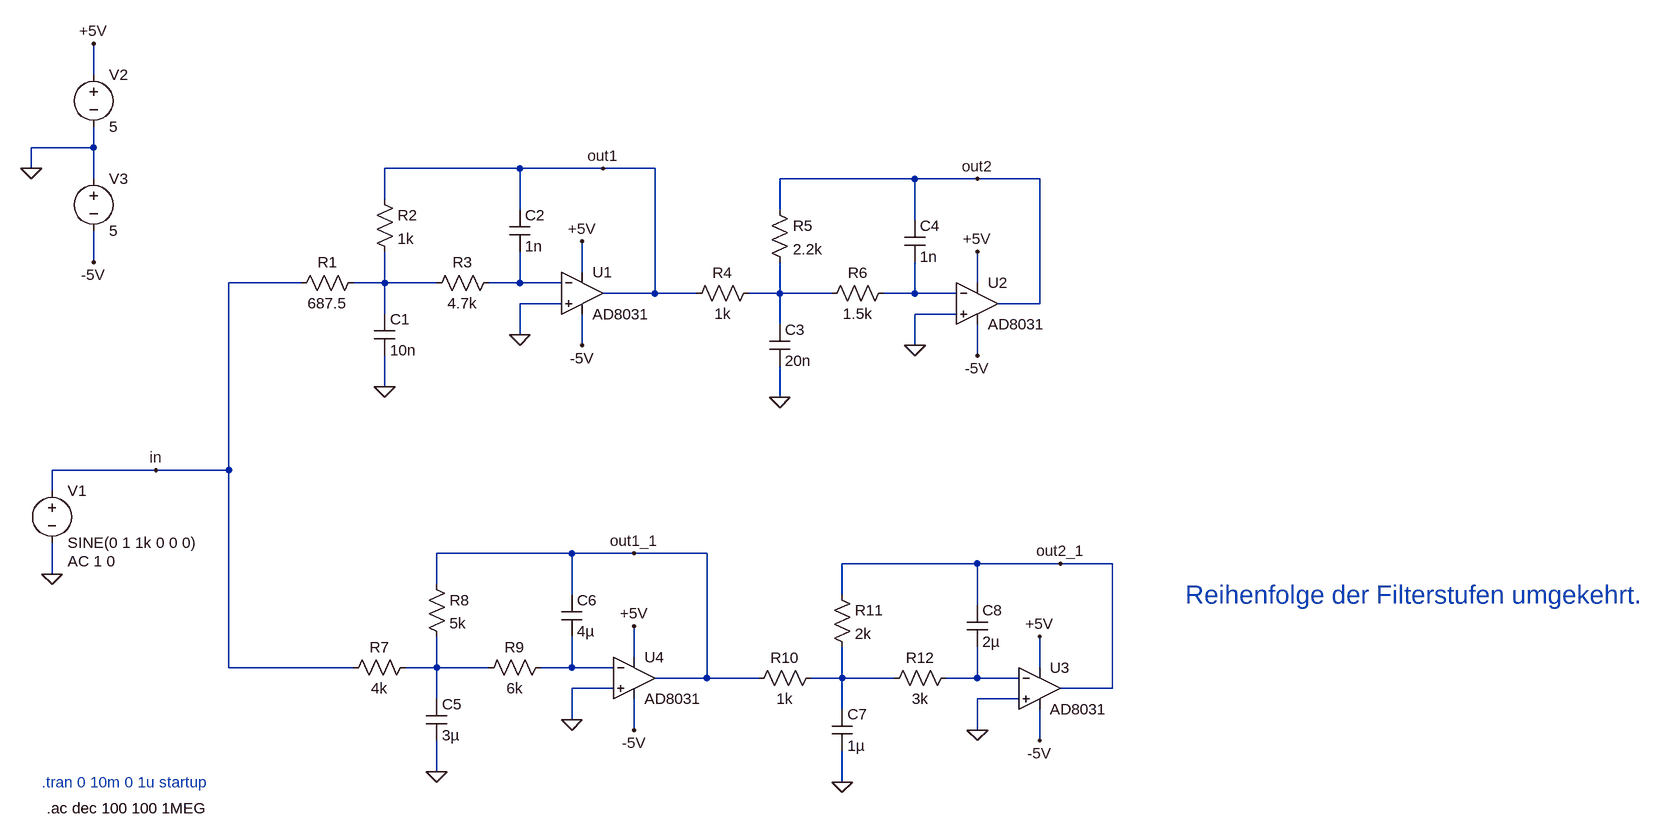
[diagram p0: schematic Tiefpass_Ordnung_4.asc]
Tiefpass_Ordnung_4.asc, the LTspice schematic file:
Version 4
SHEET 1 2400 680
WIRE -640 -464 -640 -512
WIRE -640 -352 -640 -384
WIRE -640 -352 -736 -352
WIRE -736 -320 -736 -352
WIRE 16 -320 -192 -320
WIRE 144 -320 16 -320
WIRE 224 -320 144 -320
WIRE -640 -304 -640 -352
WIRE 624 -304 416 -304
WIRE 720 -304 624 -304
WIRE 816 -304 720 -304
WIRE -192 -272 -192 -320
WIRE 16 -256 16 -320
WIRE 416 -256 416 -304
WIRE 624 -240 624 -304
WIRE -640 -176 -640 -224
WIRE 112 -160 112 -208
WIRE -320 -144 -432 -144
WIRE -192 -144 -192 -192
WIRE -192 -144 -240 -144
WIRE -112 -144 -192 -144
WIRE 16 -144 16 -192
WIRE 16 -144 -32 -144
WIRE 80 -144 16 -144
WIRE 720 -144 720 -192
WIRE 224 -128 224 -320
WIRE 224 -128 144 -128
WIRE 288 -128 224 -128
WIRE 416 -128 416 -176
WIRE 416 -128 368 -128
WIRE 496 -128 416 -128
WIRE 624 -128 624 -176
WIRE 624 -128 576 -128
WIRE 688 -128 624 -128
WIRE 80 -112 16 -112
WIRE 816 -112 816 -304
WIRE 816 -112 752 -112
WIRE -192 -96 -192 -144
WIRE 688 -96 624 -96
WIRE 416 -80 416 -128
WIRE 16 -64 16 -112
WIRE 112 -48 112 -96
WIRE 624 -48 624 -96
WIRE 720 -32 720 -80
WIRE -192 16 -192 -32
WIRE 416 32 416 -16
WIRE -544 144 -704 144
WIRE -432 144 -432 -144
WIRE -432 144 -544 144
WIRE -704 176 -704 144
WIRE 96 272 -112 272
WIRE 192 272 96 272
WIRE 304 272 192 272
WIRE 720 288 512 288
WIRE 848 288 720 288
WIRE 928 288 848 288
WIRE -704 304 -704 256
WIRE -112 320 -112 272
WIRE 96 336 96 272
WIRE 512 336 512 288
WIRE 720 352 720 288
WIRE 192 432 192 384
WIRE -432 448 -432 144
WIRE -240 448 -432 448
WIRE -112 448 -112 400
WIRE -112 448 -160 448
WIRE -32 448 -112 448
WIRE 96 448 96 400
WIRE 96 448 48 448
WIRE 160 448 96 448
WIRE 816 448 816 400
WIRE 304 464 304 272
WIRE 304 464 224 464
WIRE 384 464 304 464
WIRE 512 464 512 416
WIRE 512 464 464 464
WIRE 592 464 512 464
WIRE 720 464 720 416
WIRE 720 464 672 464
WIRE 784 464 720 464
WIRE 160 480 96 480
WIRE 928 480 928 288
WIRE 928 480 848 480
WIRE -112 496 -112 448
WIRE 784 496 720 496
WIRE 512 512 512 464
WIRE 96 528 96 480
WIRE 192 544 192 496
WIRE 720 544 720 496
WIRE 816 560 816 512
WIRE -112 608 -112 560
WIRE 512 624 512 576
FLAG 416 32 0
FLAG 624 -48 0
FLAG 720 -304 out2
FLAG -704 304 0
FLAG -112 608 0
FLAG 96 528 0
FLAG -544 144 in
FLAG 192 272 out1_1
FLAG -736 -320 0
FLAG -640 -512 +5V
FLAG -640 -176 -5V
FLAG 720 -192 +5V
FLAG 192 384 +5V
FLAG 192 544 -5V
FLAG 720 -32 -5V
FLAG -192 16 0
FLAG 16 -64 0
FLAG 112 -208 +5V
FLAG 112 -48 -5V
FLAG 144 -320 out1
FLAG 512 624 0
FLAG 720 544 0
FLAG 816 400 +5V
FLAG 816 560 -5V
FLAG 848 288 out2_1
SYMBOL res 272 -112 R270
WINDOW 0 32 56 VTop 2
WINDOW 3 0 56 VBottom 2
SYMATTR InstName R4
SYMATTR Value 1k
SYMBOL res 400 -272 R0
SYMATTR InstName R5
SYMATTR Value 2.2k
SYMBOL res 592 -144 R90
WINDOW 0 0 56 VBottom 2
WINDOW 3 32 56 VTop 2
SYMATTR InstName R6
SYMATTR Value 1.5k
SYMBOL cap 400 -80 R0
SYMATTR InstName C3
SYMATTR Value 20n
SYMBOL cap 608 -240 R0
SYMATTR InstName C4
SYMATTR Value 1n
SYMBOL voltage -704 160 R0
WINDOW 123 24 124 Left 2
WINDOW 39 0 0 Left 2
SYMATTR Value2 AC 1 0
SYMATTR InstName V1
SYMATTR Value SINE(0 1 1k 0 0 0)
SYMBOL res -256 464 R270
WINDOW 0 32 56 VTop 2
WINDOW 3 0 56 VBottom 2
SYMATTR InstName R7
SYMATTR Value 4k
SYMBOL res -128 304 R0
SYMATTR InstName R8
SYMATTR Value 5k
SYMBOL res 64 432 R90
WINDOW 0 0 56 VBottom 2
WINDOW 3 32 56 VTop 2
SYMATTR InstName R9
SYMATTR Value 6k
SYMBOL cap -128 496 R0
SYMATTR InstName C5
SYMATTR Value 3µ
SYMBOL cap 80 336 R0
SYMATTR InstName C6
SYMATTR Value 4µ
SYMBOL voltage -640 -480 R0
WINDOW 123 0 0 Left 2
WINDOW 39 24 44 Left 2
SYMATTR InstName V2
SYMATTR Value 5
SYMBOL voltage -640 -320 R0
WINDOW 123 0 0 Left 2
WINDOW 39 0 0 Left 2
SYMATTR InstName V3
SYMATTR Value 5
SYMBOL res -336 -128 R270
WINDOW 0 32 56 VTop 2
WINDOW 3 0 56 VBottom 2
SYMATTR InstName R1
SYMATTR Value 687.5
SYMBOL res -208 -288 R0
SYMATTR InstName R2
SYMATTR Value 1k
SYMBOL res -16 -160 R90
WINDOW 0 0 56 VBottom 2
WINDOW 3 32 56 VTop 2
SYMATTR InstName R3
SYMATTR Value 4.7k
SYMBOL cap -208 -96 R0
SYMATTR InstName C1
SYMATTR Value 10n
SYMBOL cap 0 -256 R0
SYMATTR InstName C2
SYMATTR Value 1n
SYMBOL res 368 480 R270
WINDOW 0 32 56 VTop 2
WINDOW 3 0 56 VBottom 2
SYMATTR InstName R10
SYMATTR Value 1k
SYMBOL res 496 320 R0
SYMATTR InstName R11
SYMATTR Value 2k
SYMBOL res 688 448 R90
WINDOW 0 0 56 VBottom 2
WINDOW 3 32 56 VTop 2
SYMATTR InstName R12
SYMATTR Value 3k
SYMBOL cap 496 512 R0
SYMATTR InstName C7
SYMATTR Value 1µ
SYMBOL cap 704 352 R0
SYMATTR InstName C8
SYMATTR Value 2µ
SYMBOL Opamps\\AD8031 112 -192 R0
SYMATTR InstName U1
SYMBOL Opamps\\AD8031 720 -176 R0
SYMATTR InstName U2
SYMBOL Opamps\\AD8031 816 416 R0
SYMATTR InstName U3
SYMBOL Opamps\\AD8031 192 400 R0
SYMATTR InstName U4
TEXT -720 624 Left 2 ;.tran 0 10m 0 1u startup
TEXT 1040 336 Left 4 ;Reihenfolge der Filterstufen umgekehrt.
TEXT -712 664 Left 2 !.ac dec 100 100 1MEG

The netlist it stands for:
* Tiefpass_Ordnung_4.asc
R4 out1 N003 1k
R5 out2 N003 2.2k
R6 N004 N003 1.5k
C3 N003 0 20n
C4 out2 N004 1n
V1 in 0 SINE(0 1 1k 0 0 0) AC 1 0
R7 in N005 4k
R8 out1_1 N005 5k
R9 N006 N005 6k
C5 N005 0 3µ
C6 out1_1 N006 4µ
V2 +5V 0 5
V3 0 -5V 5
R1 in N001 687.5
R2 out1 N001 1k
R3 N002 N001 4.7k
C1 N001 0 10n
C2 out1 N002 1n
R10 out1_1 N007 1k
R11 out2_1 N007 2k
R12 N008 N007 3k
C7 N007 0 1µ
C8 out2_1 N008 2µ
XU1 0 N002 +5V -5V out1 AD8031  ; pins In+ In- V+ V- OUT
XU2 0 N004 +5V -5V out2 AD8031  ; pins In+ In- V+ V- OUT
XU3 0 N008 +5V -5V out2_1 AD8031  ; pins In+ In- V+ V- OUT
XU4 0 N006 +5V -5V out1_1 AD8031  ; pins In+ In- V+ V- OUT
* .tran 0 10m 0 1u startup
* Reihenfolge der Filterstufen umgekehrt.
.ac dec 100 100 1MEG
.backanno
.end